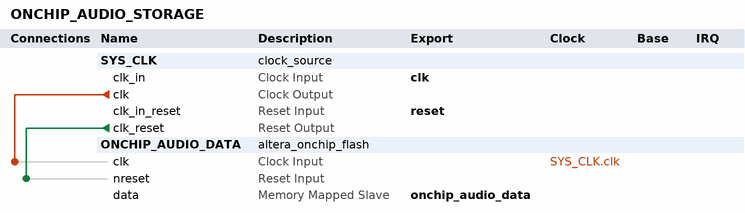
[diagram p0: system contents]
# Platform Designer (Qsys) system ONCHIP_AUDIO_STORAGE, MAX 10 10M50DAF484C7G
# Parameters at their usual value, and those the tool derives, are not listed.
package require -exact qsys 23.1
create_system ONCHIP_AUDIO_STORAGE
set_project_property DEVICE_FAMILY {MAX 10}
set_project_property DEVICE 10M50DAF484C7G

add_instance SYS_CLK clock_source 23.1
set_instance_parameter_value SYS_CLK clockFrequency 50000000

add_instance ONCHIP_AUDIO_DATA altera_onchip_flash 23.1
set_instance_parameter_value ONCHIP_AUDIO_DATA CLOCK_FREQUENCY 50.0
set_instance_parameter_value ONCHIP_AUDIO_DATA CONFIGURATION_MODE {Single Compressed Image}
set_instance_parameter_value ONCHIP_AUDIO_DATA SECTOR_ACCESS_MODE {Read only,Read only,Read only,Read only,Read only}
set_instance_parameter_value ONCHIP_AUDIO_DATA initFlashContent true
set_instance_parameter_value ONCHIP_AUDIO_DATA initializationFileNameForSim {C:/Users/admin/OneDrive - Juventus Schulen/Dokumente/Juventus/Diplom/Diplomarbeit/VHDL/VHDL_Ident-Player/Source/TEST_SINE_1kHz_WAV.mif}
set_instance_parameter_value ONCHIP_AUDIO_DATA useNonDefaultInitFile true

# connections
add_connection SYS_CLK.clk ONCHIP_AUDIO_DATA.clk clock
add_connection SYS_CLK.clk_reset ONCHIP_AUDIO_DATA.nreset reset

# exported interfaces
add_interface clk clock sink
set_interface_property clk EXPORT_OF SYS_CLK.clk_in
add_interface onchip_audio_data avalon slave
set_interface_property onchip_audio_data EXPORT_OF ONCHIP_AUDIO_DATA.data
add_interface reset reset sink
set_interface_property reset EXPORT_OF SYS_CLK.clk_in_reset

set_interconnect_requirement {$system} qsys_mm.clockCrossingAdapter HANDSHAKE
set_interconnect_requirement {$system} qsys_mm.enableEccProtection FALSE
set_interconnect_requirement {$system} qsys_mm.insertDefaultSlave FALSE
set_interconnect_requirement {$system} qsys_mm.maxAdditionalLatency 1

save_system ONCHIP_AUDIO_STORAGE.qsys
